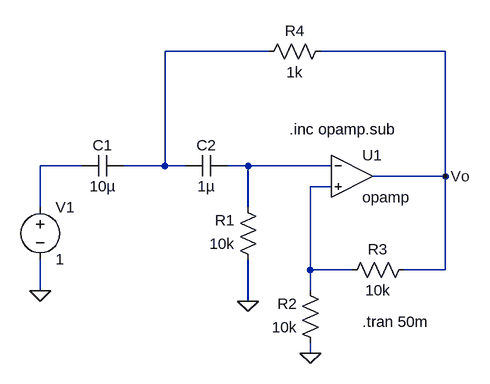
[diagram p0: schematic final3_23-07-24.asc]
final3_23-07-24.asc, the LTspice schematic file:
Version 4
SHEET 1 880 680
WIRE 464 112 304 112
WIRE 736 112 544 112
WIRE 176 288 112 288
WIRE 304 288 304 112
WIRE 304 288 240 288
WIRE 336 288 304 288
WIRE 432 288 400 288
WIRE 560 288 432 288
WIRE 736 304 736 112
WIRE 736 304 624 304
WIRE 560 320 528 320
WIRE 112 352 112 288
WIRE 432 352 432 288
WIRE 528 448 528 320
WIRE 592 448 528 448
WIRE 736 448 736 304
WIRE 736 448 672 448
WIRE 112 480 112 432
WIRE 528 480 528 448
WIRE 432 496 432 432
WIRE 528 576 528 560
FLAG 112 480 0
FLAG 432 496 0
FLAG 528 576 0
FLAG 736 304 Vo
SYMBOL Res 448 448 R180
WINDOW 0 36 76 Left 2
WINDOW 3 36 40 Left 2
SYMATTR InstName R1
SYMATTR Value 10k
SYMBOL Cap 240 272 R90
WINDOW 0 0 32 VBottom 2
WINDOW 3 32 32 VTop 2
SYMATTR InstName C1
SYMATTR Value 10µ
SYMATTR SpiceLine IC=0
SYMBOL Cap 400 272 R90
WINDOW 0 0 32 VBottom 2
WINDOW 3 32 32 VTop 2
SYMATTR InstName C2
SYMATTR Value 1µ
SYMATTR SpiceLine IC=0
SYMBOL Voltage 112 336 R0
SYMATTR InstName V1
SYMATTR Value 1
SYMBOL OpAmps/opamp 592 240 R0
SYMATTR InstName U1
SYMBOL Res 544 576 R180
WINDOW 0 36 76 Left 2
WINDOW 3 36 40 Left 2
SYMATTR InstName R2
SYMATTR Value 10k
SYMBOL Res 576 464 R270
WINDOW 0 32 56 VTop 2
WINDOW 3 0 56 VBottom 2
SYMATTR InstName R3
SYMATTR Value 10k
SYMBOL Res 560 96 R90
WINDOW 0 0 56 VBottom 2
WINDOW 3 32 56 VTop 2
SYMATTR InstName R4
SYMATTR Value 1k
TEXT 496 232 Left 2 !.inc opamp.sub
TEXT 608 528 Left 2 !.tran 50m

The netlist it stands for:
* final3_23-07-24.asc
R1 0 N003 10k
C1 N001 N002 10µ IC=0
C2 N003 N001 1µ IC=0
V1 N002 0 1
XU1 N003 N004 Vo opamp Aol=100K GBW=10Meg  ; pins invin noninvin out
R2 0 N004 10k
R3 N004 Vo 10k
R4 Vo N001 1k
.inc opamp.sub
.tran 50m
.backanno
.end